# Altium schematic sheet digital logic.SchDoc
size A4
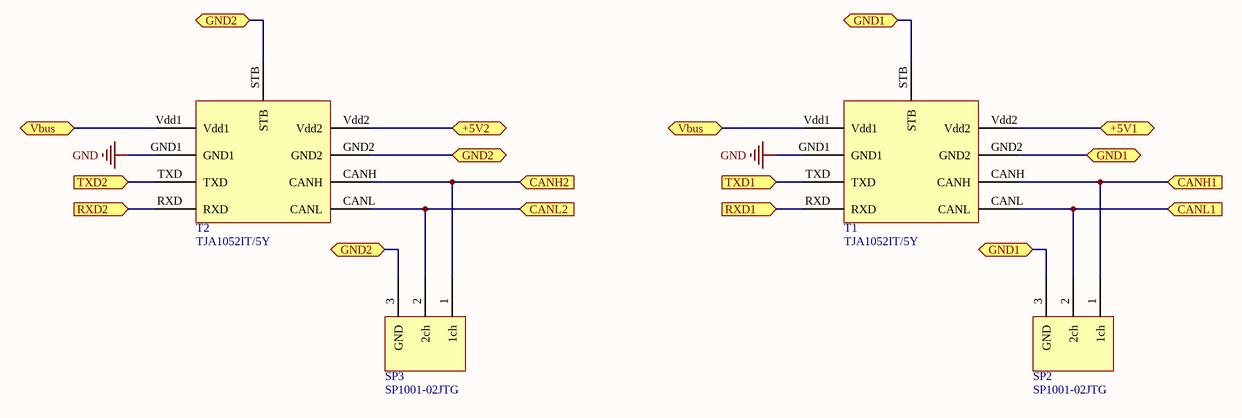
[diagram p0: digital logic.SchDoc]

## Parts
SP2  SP1001-02JTG  [SC70-3]
SP3  SP1001-02JTG  [SC70-3]
T1  TJA1052IT/5Y  [TJA1052]
T2  TJA1052IT/5Y  [TJA1052]

## Ports
+5V1 (bidir), +5V2 (bidir), CANH1 (in), CANH2 (in), CANL1 (in), CANL2 (in), GND1 (bidir), GND2 (bidir), RXD1 (in), RXD2 (in), TXD1 (in), TXD2 (in), Vbus (bidir)

## Nets
GND: T1.GND1 T2.GND1
+5V1: T1.Vdd2 ; port +5V1
+5V2: T2.Vdd2 ; port +5V2
CANH1: SP2.1(1ch) T1.CANH ; port CANH1
CANH2: SP3.1(1ch) T2.CANH ; port CANH2
CANL1: SP2.2(2ch) T1.CANL ; port CANL1
CANL2: SP3.2(2ch) T2.CANL ; port CANL2
GND1: SP2.3(GND) T1.GND2 T1.STB ; port GND1
GND2: SP3.3(GND) T2.GND2 T2.STB ; port GND2
RXD1: T1.RXD ; port RXD1
RXD2: T2.RXD ; port RXD2
TXD1: T1.TXD ; port TXD1
TXD2: T2.TXD ; port TXD2
Vbus: T1.Vdd1 T2.Vdd1 ; port Vbus

## Library data of the parts
T1 T2 = TJA1052IT/5Y: ComponentLink1Description: New link; ComponentLink1URL: https://lcsc.com/product-detail/CAN-ICs_NXP-Semicon_TJA1052IT-5Y_NXP-Semicon-TJA1052IT-5Y_C92210.html